# Altium schematic sheet sensor.SchDoc
size A4
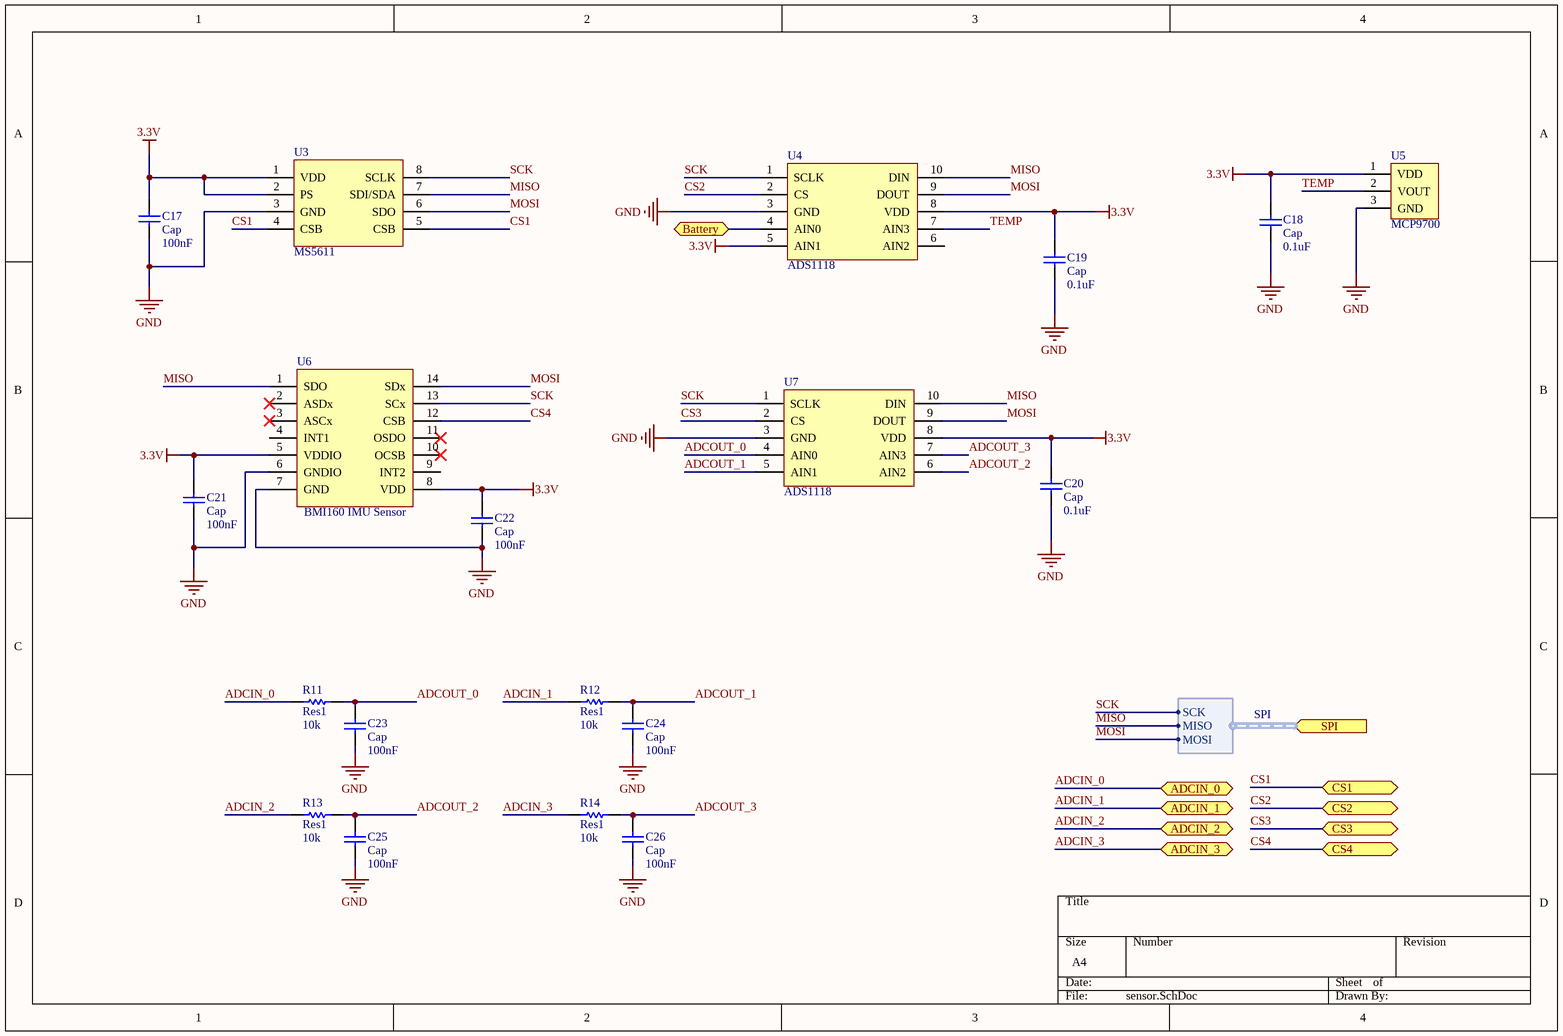
[diagram p0: sensor.SchDoc]

## Parts
C17  Cap  value 100nF  [0805-CAP]
C18  Cap  value 0.1uF  [0805-CAP]
C19  Cap  value 0.1uF  [0805-CAP]
C20  Cap  value 0.1uF  [0805-CAP]
C21  Cap  value 100nF  [0805-CAP]
C22  Cap  value 100nF  [0805-CAP]
C23  Cap  value 100nF  [0805-CAP]
C24  Cap  value 100nF  [0805-CAP]
C25  Cap  value 100nF  [0805-CAP]
C26  Cap  value 100nF  [0805-CAP]
R11  Res1  value 10k  [0805-RES]
R12  Res1  value 10k  [0805-RES]
R13  Res1  value 10k  [0805-RES]
R14  Res1  value 10k  [0805-RES]
U3  MS5611  [MS5611-01BA03]
U4  ADS1118  [MSOP10]
U5  MCP9700  [SOT23-3 (TO-236AB)]
U6  BMI160 IMU Sensor  [BMI160]
U7  ADS1118  [MSOP10]

## Ports
ADCIN_0, ADCIN_1, ADCIN_2, ADCIN_3, Battery, CS1, CS2, CS3, CS4, SPI (harness SPI)

## Harnesses
SPI: SCK, MISO, MOSI

## Nets
3.3V: C17.1 C18.1 C19.1 C20.1 C21.1 C22.1 U3.1(VDD) U3.2(PS) U4.5(AIN1) U4.8(VDD) U5.1(VDD) U6.5(VDDIO) U6.8(VDD) U7.8(VDD)
GND: C17.2 C18.2 C19.2 C20.2 C21.2 C22.2 C23.2 C24.2 C25.2 C26.2 U3.3(GND) U4.3(GND) U5.3(GND) U6.6(GNDIO) U6.7(GND) U7.3(GND)
ADCIN_0: R11.1 ; port ADCIN_0
ADCIN_1: R12.1 ; port ADCIN_1
ADCIN_2: R13.1 ; port ADCIN_2
ADCIN_3: R14.1 ; port ADCIN_3
ADCOUT_0: C23.1 R11.2 U7.4(AIN0)
ADCOUT_1: C24.1 R12.2 U7.5(AIN1)
ADCOUT_2: C25.1 R13.2 U7.6(AIN2)
ADCOUT_3: C26.1 R14.2 U7.7(AIN3)
Battery: U4.4(AIN0) ; port Battery
CS1: U3.4(CSB) U3.5(CSB) ; port CS1
CS2: U4.2(CS) ; port CS2
CS3: U7.2(CS) ; port CS3
CS4: U6.12(CSB) ; port CS4
MISO: U3.7(SDI/SDA) U4.10(DIN) U6.1(SDO) U7.10(DIN) ; port SPI.MISO
MOSI: U3.6(SDO) U4.9(DOUT) U6.14(SDx) U7.9(DOUT) ; port SPI.MOSI
SCK: U3.8(SCLK) U4.1(SCLK) U6.13(SCx) U7.1(SCLK) ; port SPI.SCK
TEMP: U4.7(AIN3) U5.2(VOUT)

Not connected (* = marked no-connect by the designer): U4 6(AIN2); U6 2(ASDx)* 3(ASCx)* 4(INT1) 9(INT2) 10(OCSB)* 11(OSDO)*

## Library data of the parts
C17-C26 = Cap: Capacitor; Published: 8-Jun-2000; LatestRevisionDate: 17-Jul-2002; LatestRevisionNote: Re-released for DXP Platform.; PackageReference: RAD-0.3; Publisher: Altium Limited; PackageDescription: Radial Cap, Thru-Hole; 2 Leads; 0.3 in Pin Spacing
R11-R14 = Res1: Resistor; Published: 8-Jun-2000; LatestRevisionDate: 17-Jul-2002; LatestRevisionNote: Re-released for DXP Platform.; PackageReference: AXIAL-0.3; Publisher: Altium Limited; PackageDescription: Axial Device, Thru-Hole; 2 Leads; 0.3 in Pin Spacing
U3 = MS5611: MS5611 Barometer I2C/SPI
U4 U7 = ADS1118: ADS1118 SPI 4 Channel ADC
U5 = MCP9700: MCP9700 Linear Temperature Sensor
U6 = BMI160 IMU Sensor: BoschTech BMI160 6 Axis IMU Sensor